# Altium schematic sheet CAN-SPI.SchDoc
size A
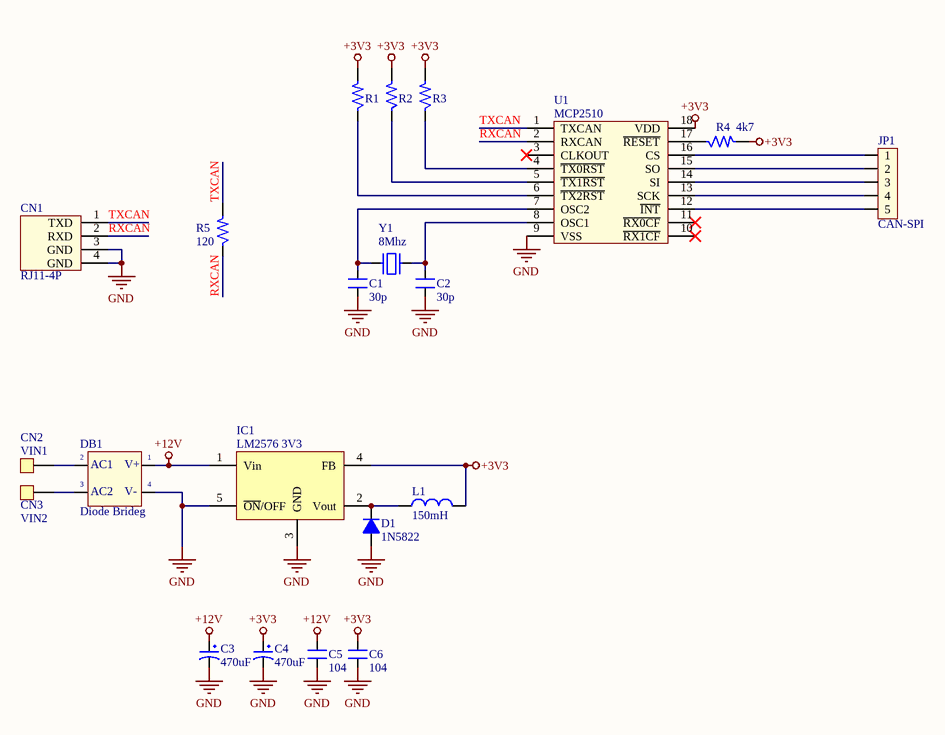
[diagram p0: CAN-SPI.SchDoc]

## Parts
C1  30p  [C-0805]
C2  30p  [C-0805]
C3  470uF  [C-ALU-D6.5]
C4  470uF  [C-ALU-D6.5]
C5  104  [C-0805]
C6  104  [C-0805]
CN1  RJ11-4P
CN2  VIN1  [M3]
CN3  VIN2  [M3]
D1  1N5822  [D-DO214-AB]
DB1  Diode Brideg  [D-DB-1A-SMD]
IC1  LM2576 3V3  [TO-263-5L]
JP1  CAN-SPI  [JP5]
L1  150mH  [L-SMD-10x10]
R1  100k  [R-0805]  (value not drawn)
R2  100k  [R-0805]  (value not drawn)
R3  100k  [R-0805]  (value not drawn)
R4  4k7  [R-0805]
R5  120  [R-0805]
U1  MCP2510  [SOIC-18-W]
Y1  8Mhz  [XTAL-AB38T-SMD]

## Nets
+3V3: C4.1 C6.2 IC1.4(FB) L1.2 R1.2 R2.2 R3.2 R4.2 U1.18(VDD)
+12V: C3.1 C5.2 DB1.3(AC2) IC1.1(Vin)
GND: C1.1 C2.1 C3.2 C4.2 C5.1 C6.1 CN1.3(GND) CN1.4(GND) D1.1(A) DB1.4(-V_OUT) IC1.3(GND) IC1.5(~{ON}/OFF) IC1.HM(GND) U1.9(VSS)
RXCAN: CN1.2(RXD) R5.1 U1.2(RXCAN)
TXCAN: CN1.1(TXD) R5.2 U1.1(TXCAN)
NetC1_2: C1.2 U1.7(OSC2) Y1.1
NetC2_2: C2.2 U1.8(OSC1) Y1.2
NetCN2_1: CN2.1 DB1.2(AC1)
NetCN3_1: CN3.1 DB1.1(+V_OUT)
NetD1_2: D1.2(K) IC1.2(Vout) L1.1
NetJP1_1: JP1.1 U1.16(CS)
NetJP1_2: JP1.2 U1.15(SO)
NetJP1_3: JP1.3 U1.14(SI)
NetJP1_4: JP1.4 U1.13(SCK)
NetJP1_5: JP1.5 U1.12(~{INT})
NetR1_1: R1.1 U1.6(~{TX2RST})
NetR2_1: R2.1 U1.5(~{TX1RST})
NetR3_1: R3.1 U1.4(~{TX0RST})
NetR4_1: R4.1 U1.17(~{RESET})

Not connected (* = marked no-connect by the designer): U1 3(CLKOUT)* 10(~{RX1CF})* 11(~{RX0CF})*

## Notes on the sheet
- (in symbol DB) V+; V-

## Library data of the parts
C1 C2 C5 C6 = CN: Value: 0,1uF/300V; Designed by: VanDungEvn
C3 C4 = CP1: Cap P  0,1uF < 22uF , 16 - 50V; Value: 10uF/50V; Description 1: 10 => 220uF/6,3V/10V - 10uF => 100uF/16V; Description 2: 0,1uF => 33uF/50V - 10uF => 22uF/63V; Description 3: 0,47uF => 10uF/100V
CN2 CN3 = COCDONGM3: Value: M3
D1 = D1A: Diode 1A; Value: 1N4007
DB1 = DB: Convert AC to DC voltage, 4 pin; Value: Cau 1A
IC1 = LM2576
JP1 = JP5
L1 = L1: Inductor; Value: 150 mH
R1-R5 = R: Resistor 1/4W; Value: R1/4W - 1K
Y1 = XTAL: Value: XT
CN1 = RJ11-4P: Value: RJ11-4P
U1 = MCP2510: Value: MCP2510